# Altium schematic sheet SuperFin Baseboard pg1.SchDoc
size B; PageSetup: Record=PageOptions|CenterHorizontal=True|CenterVertical=True|PrintScale=1.09|XCorrection=1.00|YCorrection=1.00|PrintKind=0|BorderSize=5000000|LeftOffset=0|BottomOffset=0|Orientation=2|PaperLength=1000|PaperWidth=1000|Scale=100|PaperSource=7|PrintQuality=-4|MediaType=1|DitherType=10|PaperKind=Tabloid 11 x 17in|PrintScaleMode=1
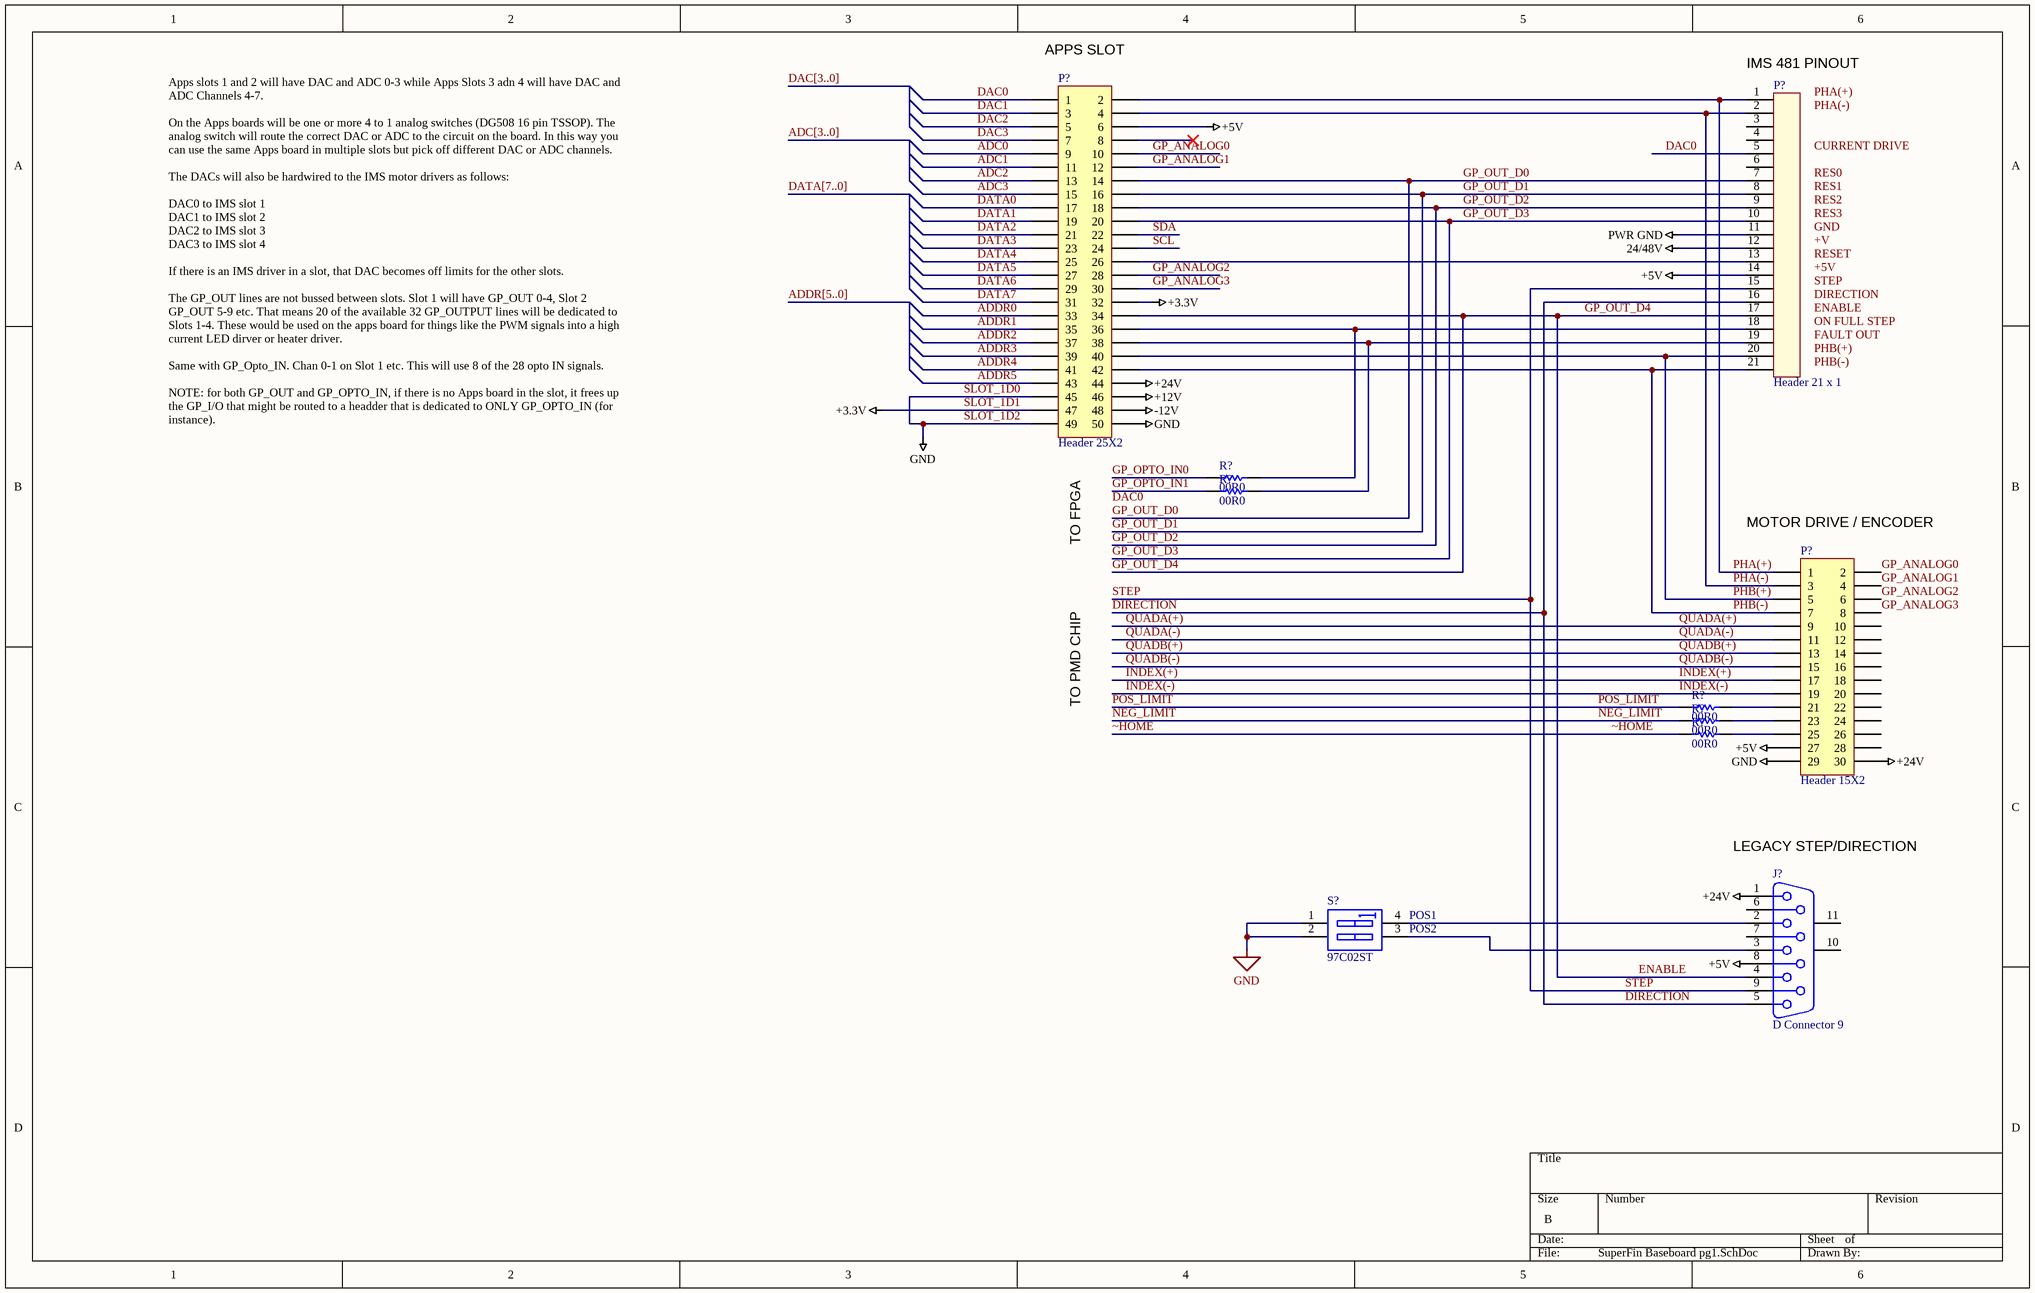
[diagram p0: SuperFin Baseboard pg1.SchDoc]

## Parts
(Parts that share a designator on the sheet are numbered #1, #2 ... from top to bottom, then left to right.)
J?  D Connector 9  [DSUB1.385-2H9]
P?#1  Header 25X2  [HDR2X25]
P?#2  Header 21 x 1
P?#3  Header 15X2  [HDR2X15]
R?#1  value 00R0  [SMD_0805]  (hidden comment: Res 0805)
R?#2  value 00R0  [SMD_0805]  (hidden comment: Res 0805)
R?#3  value 00R0  [SMD_0805]  (hidden comment: Res 0805)
R?#4  value 00R0  [SMD_0805]  (hidden comment: Res 0805)
R?#5  value 00R0  [SMD_0805]  (hidden comment: Res 0805)
S?  97C02ST  [97C02ST]

## Nets
24/48V: P?#2.12
+5V: J?.8 P?#1.6 P?#2.14 P?#3.27
+12V: P?#1.46
+24V: J?.1 P?#1.44 P?#3.30
-12V: P?#1.48
PWR GND: P?#2.11
SLOT_1D0: P?#1.45 P?#1.49 P?#1.50 P?#3.29 S?.1(A1) S?.2(A2)  [also labelled GND, SLOT_1D2]
SLOT_1D1: P?#1.32 P?#1.47  [also labelled +3.3V]
ADC0: P?#1.9
ADC1: P?#1.11
ADC2: P?#1.13
ADC3: P?#1.15
ADDR0: P?#1.33
ADDR1: P?#1.35
ADDR2: P?#1.37
ADDR3: P?#1.39
ADDR4: P?#1.41
ADDR5: P?#1.43
DAC0: P?#1.1 P?#2.5
DAC1: P?#1.3
DAC2: P?#1.5
DAC3: P?#1.7
DATA0: P?#1.17
DATA1: P?#1.19
DATA2: P?#1.21
DATA3: P?#1.23
DATA4: P?#1.25
DATA5: P?#1.27
DATA6: P?#1.29
DATA7: P?#1.31
DIRECTION: J?.5 P?#2.16
ENABLE: J?.4 P?#1.34 P?#2.17  [also labelled GP_OUT_D4]
GP_ANALOG0: P?#1.10 P?#3.2
GP_ANALOG1: P?#1.12 P?#3.4
GP_ANALOG2: P?#1.28 P?#3.6
GP_ANALOG3: P?#1.30 P?#3.8
GP_OPTO_IN0: R?#1.1
GP_OPTO_IN1: R?#2.1
GP_OUT_D0: P?#1.14 P?#2.7
GP_OUT_D1: P?#1.16 P?#2.8
GP_OUT_D2: P?#1.18 P?#2.9
GP_OUT_D3: P?#1.20 P?#2.10
INDEX(+): P?#3.17
INDEX(-): P?#3.19
NEG_LIMIT: R?#4.1
PHA(+): P?#1.2 P?#2.1 P?#3.1
PHA(-): P?#1.4 P?#2.2 P?#3.3
PHB(+): P?#1.40 P?#2.20 P?#3.5
PHB(-): P?#1.42 P?#2.21 P?#3.7
POS_LIMIT: R?#3.1
QUADA(+): P?#3.9
QUADA(-): P?#3.11
QUADB(+): P?#3.13
QUADB(-): P?#3.15
SCL: P?#1.24
SDA: P?#1.22
STEP: J?.9 P?#2.15
~HOME: R?#5.1
NetJ?_2: J?.2 S?.4(B1)
NetJ?_3: J?.3 S?.3(B2)
NetP?#1_26: P?#1.26 P?#2.13
NetP?#1_36: P?#1.36 P?#2.18 R?#1.2
NetP?#1_38: P?#1.38 P?#2.19 R?#2.2
NetP?#3_21: P?#3.21 R?#3.2
NetP?#3_23: P?#3.23 R?#4.2
NetP?#3_25: P?#3.25 R?#5.2

Not connected (* = marked no-connect by the designer): J? 6 7 10(MH1) 11(MH2); P?#1 8*; P?#2 3 4 6; P?#3 10 12 14 16 18 20 22 24 26 28

## Buses and harness runs
bus ADC[3..0]
bus ADDR[5..0]
bus DAC[3..0]
bus DATA[7..0]

## Notes on the sheet
- (near P?#1) APPS SLOT
- (near P?#2) IMS 481 PINOUT
- Apps slots 1 and 2 will have DAC and ADC 0-3 while Apps Slots 3 adn 4 will have DAC and ADC Channels 4-7.
  On the Apps boards will be one or more 4 to 1 analog switches (DG508 16 pin TSSOP). The analog switch will route the correct DAC or ADC to the circuit on the board. In this way you can use the same Apps board in multiple slots but pick off different DAC or ADC channels.
  The DACs will also be hardwired to the IMS motor drivers as follows:
  DAC0 to IMS slot 1
  DAC1 to IMS slot 2
  DAC2 to IMS slot 3
  DAC3 to IMS slot 4
  If there is an IMS driver in a slot, that DAC becomes off limits for the other slots.
  The GP_OUT lines are not bussed between slots. Slot 1 will have GP_OUT 0-4, Slot 2 GP_OUT 5-9 etc. That means 20 of the available 32 GP_OUTPUT lines will be dedicated to Slots 1-4. These would be used on the apps board for things like the PWM signals into a high current LED dirver or heater driver.
  Same with GP_Opto_IN. Chan 0-1 on Slot 1 etc. This will use 8 of the 28 opto IN signals.
  NOTE: for both GP_OUT and GP_OPTO_IN, if there is no Apps board in the slot, it frees up the GP_I/O that might be routed to a headder that is dedicated to ONLY GP_OPTO_IN (for instance).
- TO FPGA
- (near P?#3) MOTOR DRIVE / ENCODER
- TO PMD CHIP
- (near J?) LEGACY STEP/DIRECTION
- (near S?) POS1
- (near S?) POS2
- Labels drawn without touching a wire or pin: +5V, +V, CURRENT DRIVE, DAC0, DIRECTION, ENABLE, FAULT OUT, GND, ON FULL STEP, PHA(+), PHA(-), PHB(+), PHB(-), RES0, RES1, RES2, RES3, RESET, STEP

## Library data of the parts
J? = D Connector 9: Receptacle Assembly, 9 Position, Right Angle; PackageDocument: O; Positions: 9; Published: 15-Jun-2001; LatestRevisionDate: 17-Jul-2002; LatestRevisionNote: Re-released for DXP Platform.; DatasheetDocument: 1-Sep-1999; PackageReference: 788750; Publisher: Altium Limited; Orientation: Right Angle; Gender: Receptacle
P?#1 = Header 25X2: Header, 25-Pin, Dual row; LatestRevisionDate: 17-Jul-2002; LatestRevisionNote: Re-released for DXP Platform.; Publisher: Altium Limited
P?#2 = Header 21 x 1: 21 pin header for IMS motor driver
P?#3 = Header 15X2: Header, 15-Pin, Dual row; LatestRevisionDate: 17-Jul-2002; LatestRevisionNote: Re-released for DXP Platform.; Publisher: Altium Limited
R?#1-R?#5 = Res SMD: Resistor 0805; Manufacturer: Vishay/Dale; Manuf p/n: CRCW080500R0FKEA; Vendor: DIGIKEY; Vendor p/n: 541-00R0CCT-ND; Vendor Mult.: 10; COST: 0.09
S? = SW DIP-2: DIP Switch, 2 Position, SPST; Manufacturer: Grayhill; Vendor: DIGIKEY; Vendor Mult.: 1; Vendor p/n: GH1370-ND; LCO p/n: 185-00008; COST: 1.97; Manuf p/n: 97C02ST; Value: SW DIP-2